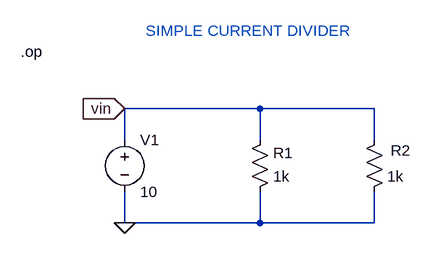
[diagram p0: schematic current divider.asc]
current divider.asc, the LTspice schematic file:
Version 4
SHEET 1 880 680
WIRE 240 112 32 112
WIRE 416 112 240 112
WIRE 32 160 32 112
WIRE 240 160 240 112
WIRE 416 160 416 112
WIRE 32 288 32 240
WIRE 240 288 240 240
WIRE 240 288 32 288
WIRE 416 288 416 240
WIRE 416 288 240 288
FLAG 32 288 0
FLAG 32 112 vin
IOPIN 32 112 In
SYMBOL voltage 32 144 R0
SYMATTR InstName V1
SYMATTR Value 10
SYMBOL res 224 256 M180
WINDOW 0 36 76 Left 2
WINDOW 3 36 40 Left 2
SYMATTR InstName R1
SYMATTR Value 1k
SYMBOL res 400 256 M180
WINDOW 0 41 80 Left 2
WINDOW 3 36 40 Left 2
SYMATTR InstName R2
SYMATTR Value 1k
TEXT 64 -8 Left 2 ;SIMPLE CURRENT DIVIDER
TEXT -128 24 Left 2 !.op

The netlist it stands for:
* current divider.asc
V1 vin 0 10
R1 0 vin 1k
R2 0 vin 1k
* SIMPLE CURRENT DIVIDER
.op
.backanno
.end